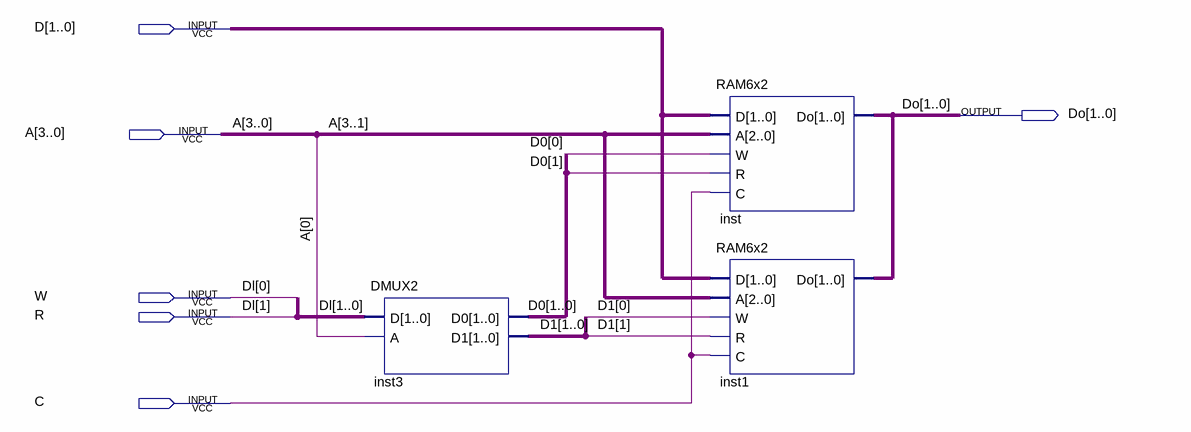
[diagram p0: schematic sheet]
// Quartus schematic RAM_12x2_with_delamination.bdf as structural Verilog: 3 symbols, 6 pins
module RAM_12x2_with_delamination (
  input  [1:0] D,
  input  [3:0] A,
  input  W,
  input  R,
  input  C,
  output [1:0] Do
);

  wire [1:0] D0, D1;

  DMUX2 inst3 (.D({R, W}), .A(A[0]), .D0(D0), .D1(D1));
  RAM6x2 inst (.D(D), .A(A[3:1]), .W(D0[0]), .R(D0[1]), .C(C), .Do(Do));
  RAM6x2 inst1 (.D(D), .A(A[3:1]), .W(D1[0]), .R(D1[1]), .C(C), .Do(Do));

  // Other names for the same wires on the sheet: Dl[1:0] = {R, W}
endmodule
